# EAGLE design wiichuck_adapter (EAGLE 4.16)
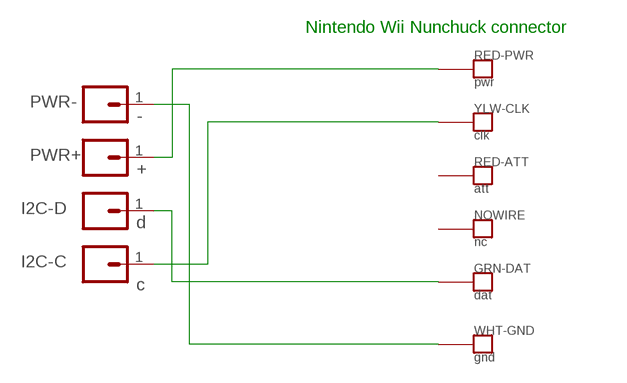
[diagram p0: schematic, sheet 1]

## Parts
GRN-DAT  dat  WII_PAD  [WII_PAD]
I2C-C  c  M01PTH  [1X01]
I2C-D  d  M01PTH  [1X01]
NOWIRE  nc  WII_PAD  [WII_PAD]
PWR+  +  M01PTH  [1X01]
PWR-  -  M01PTH  [1X01]
RED-ATT  att  WII_PAD  [WII_PAD]
RED-PWR  pwr  WII_PAD  [WII_PAD]
WHT-GND  gnd  WII_PAD  [WII_PAD]
YLW-CLK  clk  WII_PAD  [WII_PAD]

## Nets
1: PWR+.1 RED-PWR.P$1
2: I2C-C.1 YLW-CLK.P$1
5: GRN-DAT.P$1 I2C-D.1
6: PWR-.1 WHT-GND.P$1
Unconnected: NOWIRE.P$1 RED-ATT.P$1

## Notes on the sheet
- Nintendo Wii Nunchuck connector

## Library data of the parts
GRN-DAT NOWIRE RED-ATT RED-PWR WHT-GND YLW-CLK = todstuff:WII_PAD
I2C-C I2C-D PWR+ PWR- = SparkFun-3-2-07:M01: Header 1 Standard 1-pin 0.1" header. Use with straight break away headers (SKU : PType-HD), right angle break away headers (PType-HD-RightAngle), swiss pins (PType-30F), machine pins (PType-MP), and female headers (PType-FH).

## Board
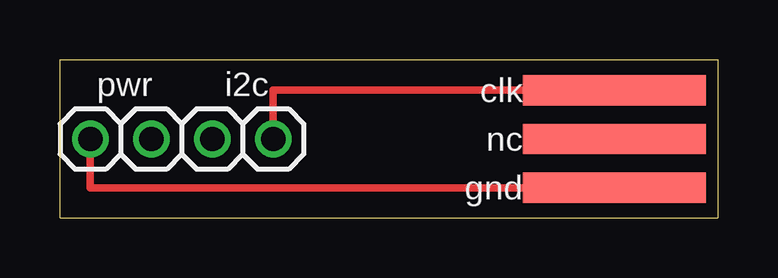
[diagram p1: board, top side]
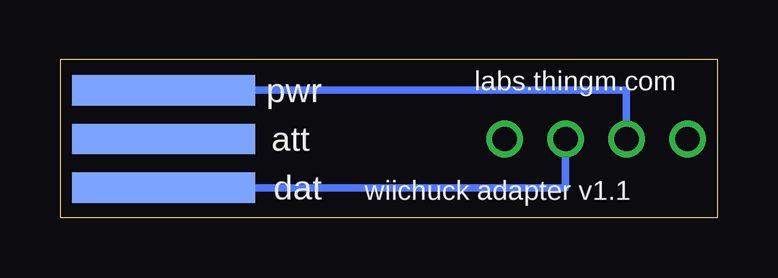
[diagram p2: board, bottom side, seen from below]

Size 27.43 x 6.6 mm. Coordinates in mm from the lower left corner, seen from the top.
Outline: 27.43,6.6 27.43,0 0,0 0,6.6 27.43,6.6
Copper layers (1*16): Top 0.0356mm / dielectric 1.5011mm / Bottom 0.0356mm
Design rules "boarduino": minimum track width 10mil, minimum drill 19mil, track to track 10mil, track to pad 10mil, pad to pad 10mil, via to via 10mil, smd to smd 0mil, copper to edge 10mil, drill to drill 8mil, minimum pad ring 10mil, minimum via ring 8mil, stop-mask expansion 4mil, vias tented up to drill 0mil, thermal gap 10mil

### Footprints (pad centres in the part's own frame; a part is rotated, then mirrored left to right if it is on the bottom)
WII_PAD = smd 7.62 x 1.27: P$1 0,0
1X01 = drill 1.016 round: 1 0,0

### Placement (x,y rotation side)
GRN-DAT  23.11,1.27 180 bottom
I2C-C  8.89,3.3 0 top
I2C-D  6.35,3.3 0 top
NOWIRE  23.11,3.3 180 top
PWR+  3.81,3.3 0 top
PWR-  1.27,3.3 0 top
RED-ATT  23.11,3.3 180 bottom
RED-PWR  23.11,5.33 180 bottom
WHT-GND  23.11,1.27 180 top
YLW-CLK  23.11,5.33 180 top

### Tracks (layer width: path | path; a pad name or v marks a point on that pad's centre or on a via)
1
  Bottom 0.305: RED-PWR.P$1 3.81,5.33 PWR+.1
2
  Top 0.305: YLW-CLK.P$1 8.89,5.33 I2C-C.1
5
  Bottom 0.305: GRN-DAT.P$1 6.35,1.27 I2C-D.1
6
  Top 0.305: WHT-GND.P$1 1.27,1.27 PWR-.1

### Text on the board
tPlace: pwr | i2c
bPlace: labs.thingm.com | wiichuck adapter v1.1